# Altium schematic sheet Cycle-Controller.SchDoc: RespiraWorks
size A3; CompanyName: RespiraWorks; DrawnBy: E. Chiu; Organization: Altium; DocumentNumber: 4; Revision: A1; SheetNumber: 4; SheetTotal: 8; PageSetup: Record=PageOptions|CenterHorizontal=True|CenterVertical=True|PrintScale=0.67|XCorrection=1.00|YCorrection=1.00|PrintKind=0|BorderSize=5000000|LeftOffset=0|BottomOffset=0|Orientation=2|PaperLength=1000|PaperWidth=1000|Scale=100|PaperSource=276|PrintQuality=-3|MediaType=1|DitherType=10|PrintScaleMode=1|PaperKind=11"x17" 279.4x431.8mm|PaperIndex=3; ProjectName: FALCON 3S
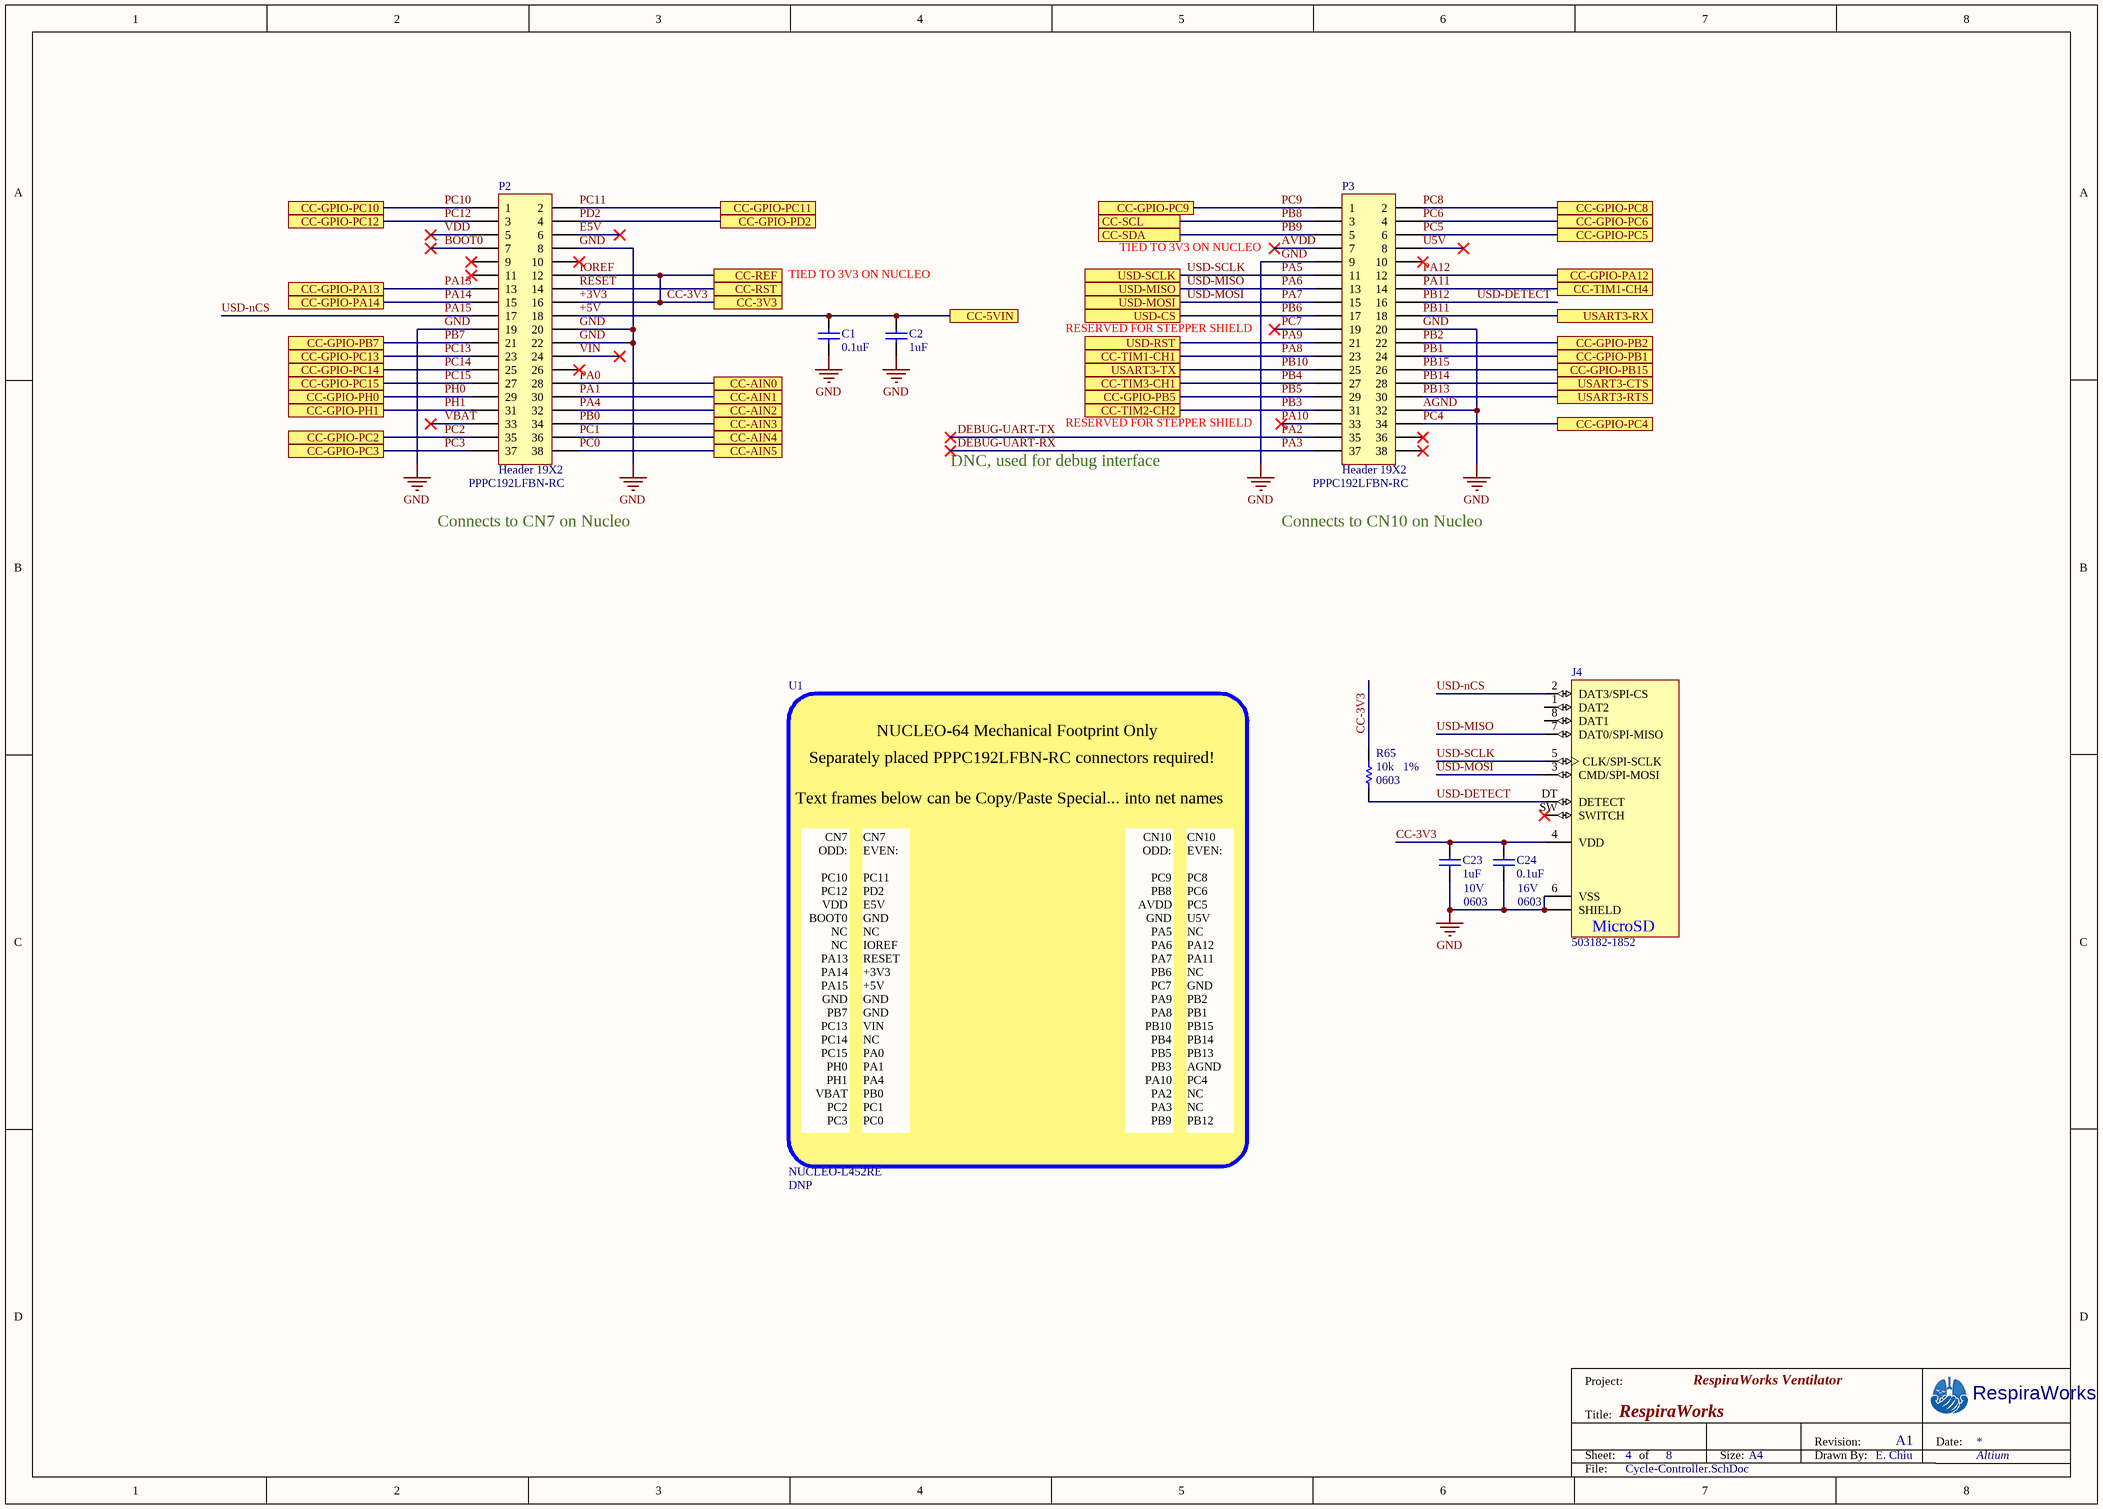
[diagram p0: Cycle-Controller.SchDoc]

## Parts
C1  value 0.1uF  [CAP0603]  (hidden comment: CAP 0603)
C2  value 1uF  [CAP0603]  (hidden comment: CAP 0603)
C23  value 1uF  Voltage: 10V  PCB Package: 0603  [CAP0603]  (hidden comment: CAP 0603)
C24  value 0.1uF  Voltage: 16V  PCB Package: 0603  [CAP0603]  (hidden comment: CAP 0603)
J4  503182-1852  [503182-1852]
P2  Header 19X2  [PPPC192LFBN-RC]
P3  Header 19X2  [PPPC192LFBN-RC]
R65  value 10k  PCB Package: 0603  Tolerance: 1%  [RES0603]  (hidden comment: RES 0603)
U1  NUCLEO-L452RE  Do Not Populate: DNP  [NUCLEO-64]

## Ports
CC-3V3, CC-5VIN, CC-AIN0, CC-AIN1, CC-AIN2, CC-AIN3, CC-AIN4, CC-AIN5, CC-GPIO-PA12, CC-GPIO-PA13, CC-GPIO-PA14, CC-GPIO-PB1, CC-GPIO-PB2, CC-GPIO-PB5, CC-GPIO-PB7, CC-GPIO-PB15, CC-GPIO-PC2, CC-GPIO-PC3, CC-GPIO-PC4, CC-GPIO-PC5, CC-GPIO-PC6, CC-GPIO-PC8, CC-GPIO-PC9, CC-GPIO-PC10, CC-GPIO-PC11, CC-GPIO-PC12, CC-GPIO-PC13, CC-GPIO-PC14, CC-GPIO-PC15, CC-GPIO-PD2, CC-GPIO-PH0, CC-GPIO-PH1, CC-REF, CC-RST, CC-SCL, CC-SDA, CC-TIM1-CH1, CC-TIM1-CH4, CC-TIM2-CH2, CC-TIM3-CH1, USART3-CTS, USART3-RTS, USART3-RX, USART3-TX, USD-CS, USD-MISO, USD-MOSI, USD-RST, USD-SCLK

## Nets
AGND: C1.2 C2.2 C23.2 C24.2 J4.6(VSS) J4.P1(SHIELD) J4.P2(SHIELD) J4.P3(SHIELD) J4.P4(SHIELD) J4.P5(SHIELD) P2.8 P2.19 P2.20 P2.22 P3.9 P3.20 P3.32  [also labelled GND]
+3V3: C23.1 C24.1 J4.4(VDD) P2.12 P2.16 R65.2 ; port CC-REF, port CC-3V3  [also labelled CC-3V3, IOREF]
+5V: C1.1 C2.1 P2.18 ; port CC-5VIN
AVDD: P3.7
BOOT0: P2.7
DEBUG-UART-RX: P3.37  [also labelled PA3]
DEBUG-UART-TX: P3.35  [also labelled PA2]
E5V: P2.6
PA0: P2.28 ; port CC-AIN0
PA1: P2.30 ; port CC-AIN1
PA4: P2.32 ; port CC-AIN2
PA5: J4.5(CLK/SPI-SCLK) P3.11 ; port USD-SCLK  [also labelled USD-SCLK]
PA6: J4.7(DAT0/SPI-MISO) P3.13 ; port USD-MISO  [also labelled USD-MISO]
PA7: J4.3(CMD/SPI-MOSI) P3.15 ; port USD-MOSI  [also labelled USD-MOSI]
PA8: P3.23 ; port CC-TIM1-CH1
PA9: P3.21 ; port USD-RST
PA10: P3.33
PA11: P3.14 ; port CC-TIM1-CH4
PA12: P3.12 ; port CC-GPIO-PA12
PA13: P2.13 ; port CC-GPIO-PA13
PA14: P2.15 ; port CC-GPIO-PA14
PA15: J4.2(DAT3/SPI-CS) P2.17  [also labelled USD-nCS]
PB0: P2.34 ; port CC-AIN3
PB1: P3.24 ; port CC-GPIO-PB1
PB2: P3.22 ; port CC-GPIO-PB2
PB3: P3.31 ; port CC-TIM2-CH2
PB4: P3.27 ; port CC-TIM3-CH1
PB5: P3.29 ; port CC-GPIO-PB5
PB6: P3.17 ; port USD-CS
PB7: P2.21 ; port CC-GPIO-PB7
PB8: P3.3 ; port CC-SCL
PB9: P3.5 ; port CC-SDA
PB10: P3.25 ; port USART3-TX
PB11: P3.18 ; port USART3-RX
PB12: J4.DT(DETECT) P3.16 R65.1  [also labelled USD-DETECT]
PB13: P3.30 ; port USART3-RTS
PB14: P3.28 ; port USART3-CTS
PB15: P3.26 ; port CC-GPIO-PB15
PC0: P2.38 ; port CC-AIN5
PC1: P2.36 ; port CC-AIN4
PC2: P2.35 ; port CC-GPIO-PC2
PC3: P2.37 ; port CC-GPIO-PC3
PC4: P3.34 ; port CC-GPIO-PC4
PC5: P3.6 ; port CC-GPIO-PC5
PC6: P3.4 ; port CC-GPIO-PC6
PC7: P3.19
PC8: P3.2 ; port CC-GPIO-PC8
PC9: P3.1 ; port CC-GPIO-PC9
PC10: P2.1 ; port CC-GPIO-PC10
PC11: P2.2 ; port CC-GPIO-PC11
PC12: P2.3 ; port CC-GPIO-PC12
PC13: P2.23 ; port CC-GPIO-PC13
PC14: P2.25 ; port CC-GPIO-PC14
PC15: P2.27 ; port CC-GPIO-PC15
PD2: P2.4 ; port CC-GPIO-PD2
PH0: P2.29 ; port CC-GPIO-PH0
PH1: P2.31 ; port CC-GPIO-PH1
RESET: P2.14 ; port CC-RST
U5V: P3.8
VBAT: P2.33
VDD: P2.5
VIN: P2.24

Not connected (* = marked no-connect by the designer): J4 1(DAT2) 8(DAT1) SW(SWITCH)*; P2 9* 10* 11* 26*; P3 10* 36* 38*

## Notes on the sheet
- TIED TO 3V3 ON NUCLEO
- RESERVED FOR STEPPER SHIELD
- DNC, used for debug interface
- Connects to CN7 on Nucleo
- Connects to CN10 on Nucleo
- Project:
- RespiraWorks Ventilator
- Title:
- Sheet:
- of
- Size:
- A4
- Drawn By:
- Revision:
- Date:
- File:
- (in symbol 503182-1852) MicroSD
- (in symbol NUCLEO-L452RE) NUCLEO-64 Mechanical Footprint Only; Separately placed PPPC192LFBN-RC connectors required!; Text frames below can be Copy/Paste Special... into net names; CN7 / ODD: / PC10 / PC12 / VDD / BOOT0 / NC / NC / PA13 / PA14 / PA15 / GND / PB7 / PC13 / PC14 / PC15 / PH0 / PH1 / VBAT / PC2 / PC3 /; CN7 / EVEN: / PC11 / PD2 / E5V / GND / NC / IOREF / RESET / +3V3 / +5V / GND / GND / VIN / NC / PA0 / PA1 / PA4 / PB0 / PC1 / PC0 /; CN10 / ODD: / PC9 / PB8 / AVDD / GND / PA5 / PA6 / PA7 / PB6 / PC7 / PA9 / PA8 / PB10 / PB4 / PB5 / PB3 / PA10 / PA2 / PA3 / PB9 /; CN10 / EVEN: / PC8 / PC6 / PC5 / U5V / NC / PA12 / PA11 / NC / GND / PB2 / PB1 / PB15 / PB14 / PB13 / AGND / PC4 / NC / NC / PB12

## Library data of the parts
C1 = CAP 0603: Manufacturer P/N: CC0603KRX7R7BB104; Manufacturer: Yageo; Voltage: 16V; PCB Package: 0603; Type: X7R; Do Not Populate: *
C2 = CAP 0603: Manufacturer P/N: CC0603KRX7R6BB105; Manufacturer: Yageo; Voltage: 10V; PCB Package: 0603; Type: X7R; Do Not Populate: *
C23 = CAP 0603: Manufacturer P/N: CC0603KRX7R6BB105; Manufacturer: Yageo; Type: X7R; Do Not Populate: *
C24 = CAP 0603: Manufacturer P/N: CC0603KRX7R7BB104; Manufacturer: Yageo; Type: X7R; Do Not Populate: *
J4 = 503182-1852: 10 _8 + 2_ Position Card Connector microSD Surface Mount, Right Angle Gold; Manufacturer: Molex; Manufacturer P/N: 5031821852; Digi-Key_Part_Number: WM12834CT-ND; Digi-Key_Purchase_URL: https://www.digikey.com.tr/product-detail/en/molex/5031821852/WM12834CT-ND/5823232?utm_source=snapeda&utm_medium=aggregator&utm_campaign=symbol; SnapEDA_Link: https://www.snapeda.com/parts/5031821852/Molex/view-part/46835/?ref=snap; Value: *; Package: None
P2 P3 = PPPC192LFBN-RC: Female Header, 0.100" Pitch, 19x2; Manufacturer: Sullins; Do Not Populate: *; Manufacturer P/N: PPPC192LFBN-RC; Value: *
R65 = RES 0603: Manufacturer P/N: ERJ-3EKF1002V; Manufacturer: Panasonic; Do Not Populate: *
U1 = NUCLEO-L452RE: STM32F446RE Nucleo MCU Board; Manufacturer: ST; Manufacturer P/N: NUCLEO-L452RE